# Altium schematic sheet RS485_RS232.SchDoc
size 152 x 152 mm
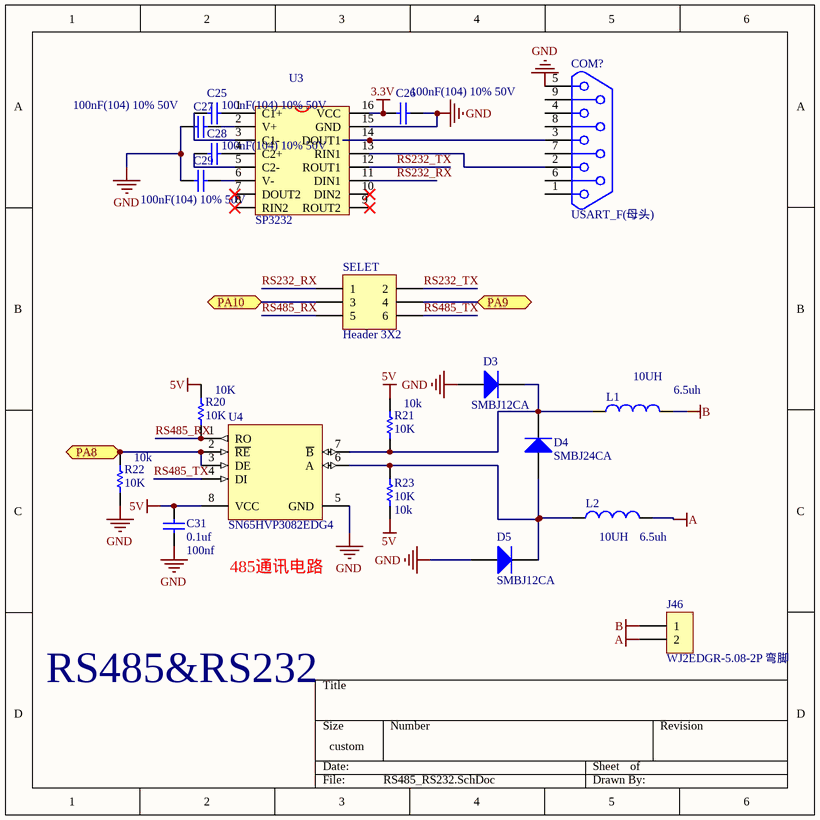
[diagram p0: RS485_RS232.SchDoc]

## Parts
C25  100nF(104) 10% 50V  [0805_C]
C26  100nF(104) 10% 50V  [0805_C]
C27  100nF(104) 10% 50V  [0805_C]
C28  100nF(104) 10% 50V  [0805_C]
C29  100nF(104) 10% 50V  [0805_C]
C31  0.1uf  value 100nf  [0805_C]
COM?  USART_F(母头)  [DB9]
D3  SMBJ12CA  [SMBJ]
D4  SMBJ24CA  [SMBJ]
D5  SMBJ12CA  [SMBJ]
J46  WJ2EDGR-5.08-2P 弯脚  [WJ2EDGR-5.08-2]
L1  10UH  value 6.5uh  [0805]
L2  10UH  value 6.5uh  [0805]
R20  10K  [0805]
R21  10K  [0805]
R22  10K  [0805]
R23  10K  [0805]
SELET  Header 3X2  [HDR2X3]
U3  SP3232  [SOP16M]
U4  SN65HVP3082EDG4  [SOIC-8_150mil]

## Ports
PA8, PA9, PA10

## Nets
3.3V: C26.2 U3.16(VCC)
5V: C31.2 R20.2 R21.2 R23.1 U4.8(VCC)
A: J46.2 L2.2
B: J46.1 L1.2
GND: C26.1 C27.1 C29.1 C31.1 COM?.5 D3.1(A) D5.1(A) R22.1 U3.15(GND) U4.5(GND)
PA8: R22.2 U4.2(~{RE}) U4.3(DE) ; port PA8
PA9: SELET.4 ; port PA9
PA10: SELET.3 ; port PA10
RS232_RX: SELET.1 U3.11(DIN1)
RS232_TX: SELET.2 U3.12(ROUT1)
RS485_RX: R20.1 SELET.5 U4.1(RO)
RS485_TX: SELET.6 U4.4(DI)
NetC25_1: C25.1 U3.3(C1-)
NetC25_2: C25.2 U3.1(C1+)
NetC27_2: C27.2 U3.2(V+)
NetC28_1: C28.1 U3.5(C2-)
NetC28_2: C28.2 U3.4(C2+)
NetC29_2: C29.2 U3.6(V-)
NetCOM?_2: COM?.2 U3.13(RIN1)
NetCOM?_3: COM?.3 U3.14(DOUT1)
NetD3_2: D3.2(K) D4.2(K) L1.1 R21.1 U4.7(~{B})
NetD4_1: D4.1(A) D5.2(K) L2.1 R23.2 U4.6(A)

Not connected (* = marked no-connect by the designer): COM? 1 4 6 7 8 9; U3 7(DOUT2)* 8(RIN2)* 9(ROUT2)* 10(DIN2)*

## Notes on the sheet
- 485通讯电路
- RS485&RS232

## Library data of the parts
C25-C29 = 0805 100nF(104) 10% 50V: 贴片电容; ComponentLink1Description: 供应商链接; ComponentLink1URL: http://www.szlcsc.com/product/details_50686.html; Package: 0805; Supplier: LC; SuppliersPartNumber: C49678
C31 = Cap: Capacitor; Published: 8-Jun-2000; LatestRevisionDate: 17-Jul-2002; LatestRevisionNote: Re-released for DXP Platform.; PackageReference: RAD-0.3; Publisher: Altium Limited; PackageDescription: Radial Cap, Thru-Hole; 2 Leads; 0.3 in Pin Spacing
COM? = DB9
D3-D5 = SMA(DO-214AC) SS210: 二极管; ComponentLink1Description: 供应商链接; ComponentLink1URL: http://www.szlcsc.com/product/details_15669.html; Package: SMA(DO-214AC); Supplier: LC; SuppliersPartNumber: C14996
J46 = WJ2EDGR-5.08-2P 弯脚: 2EDG连接器; ComponentLink1URL: https://detail.tmall.com/item.htm?spm=a1z10.5-b.w4011-14865958799.85.B0p41N&id=45355509244&rn=e90e7252b5175cd006380c5c01151190&abbucket=9; price: 0.28; Supplier: Farpu; SuppliersPartNumber: *; Manufacturer: *; ComponentLink1Description: 供应商链接
L1 L2 = Inductor: Code_IEC: 1005; Published: 8-Jun-2000; LatestRevisionDate: 29-May-2009; LatestRevisionNote: IPC-7351 Footprint Added.; PackageReference: 0402-A; Publisher: Altium Limited; PackageDescription: Chip Inductor; Code_JEITA: 0402
R20-R23 = Res1: Resistor; Published: 8-Jun-2000; LatestRevisionDate: 17-Jul-2002; LatestRevisionNote: Re-released for DXP Platform.; PackageReference: AXIAL-0.3; Publisher: Altium Limited; PackageDescription: Axial Device, Thru-Hole; 2 Leads; 0.3 in Pin Spacing
  R20: Value: 10K
  R21-R23: Value: 10k
SELET = Header 3X2: Header, 3-Pin, Dual row; LatestRevisionDate: 17-Jul-2002; LatestRevisionNote: Re-released for DXP Platform.; Publisher: Altium Limited
U3 = MAX3232
U4 = SN75176BDR_[C7063]: RS-485/RS-422; ComponentLink1Description: 供应商链接; ComponentLink1URL: http://www.szlcsc.com/product/details_7535.html; Package: SOIC-8_150mil; Supplier: LC; SuppliersPartNumber: C7063